# Altium project Multiplexer_SWD.PrjPCB (part 2 of 2)
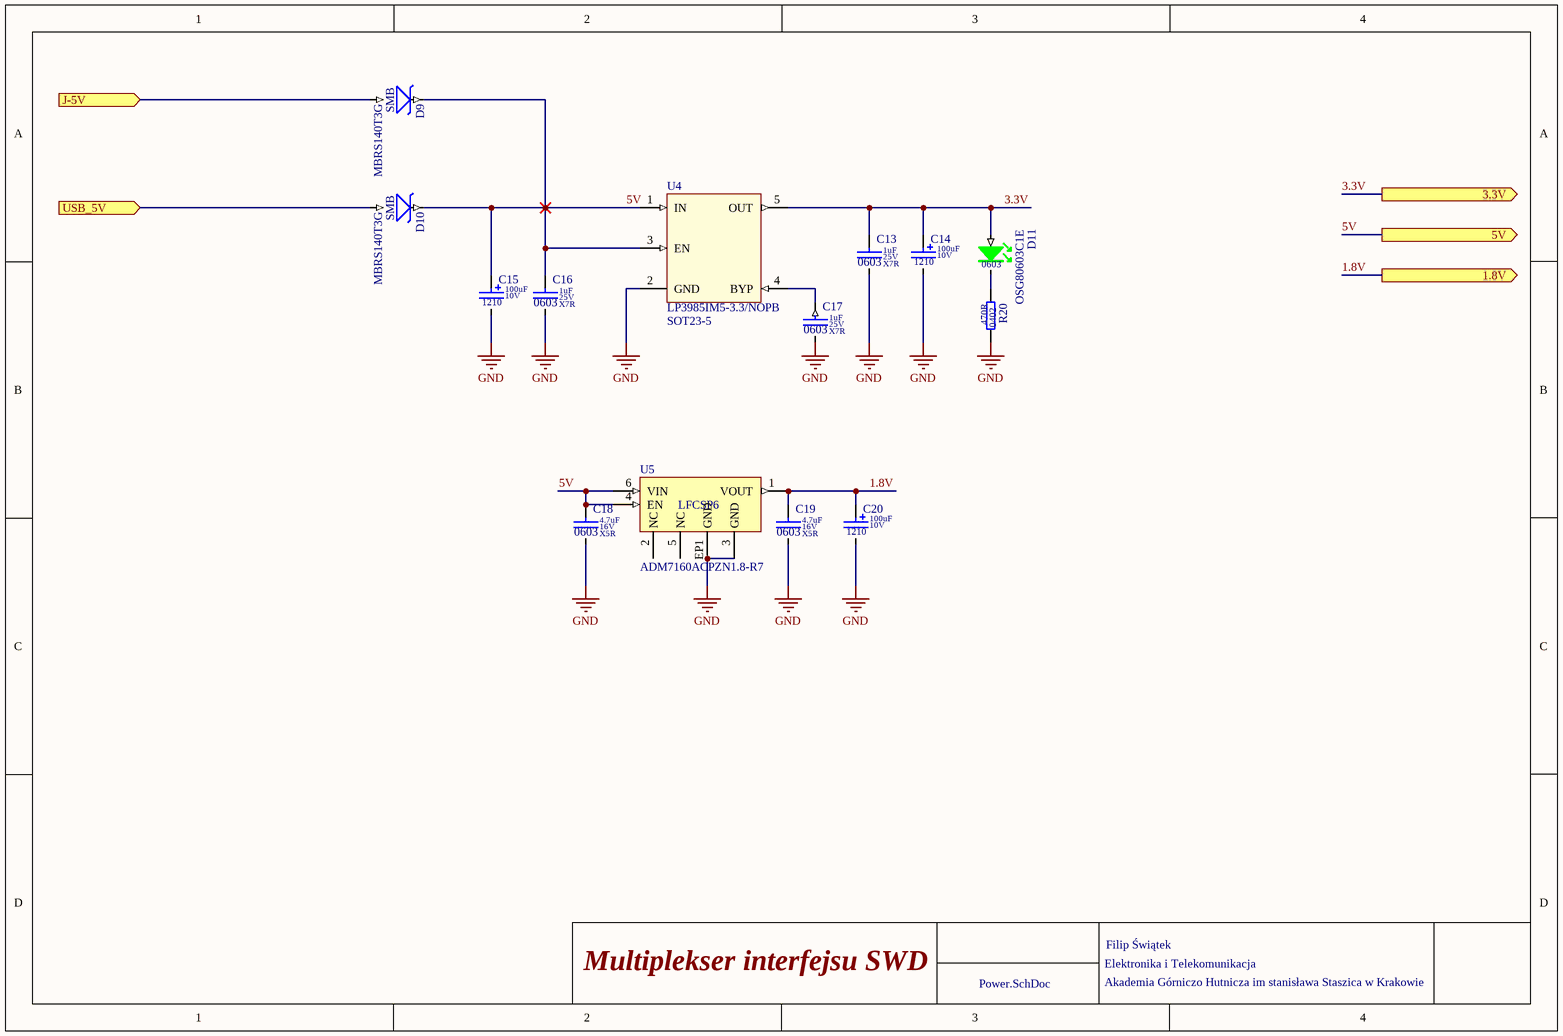
[diagram p7: Power.SchDoc]

## Nets that join several sheets
1.8V: MCU/U_TXS0102YZPR (C1_MCU_U_TXS0102YZPR#1.1 R1_MCU_U_TXS0102YZPR#1.1 U1_MCU_U_TXS0102YZPR#1.C1), MCU/U_TXS0102YZPR (C1_MCU_U_TXS0102YZPR#2.1 R1_MCU_U_TXS0102YZPR#2.1 U1_MCU_U_TXS0102YZPR#2.C1), Power (C19.1 C20.1 U5.1)
3.3V: MCU (15 pins), MCU/U_TXS0102YZPR (C2_MCU_U_TXS0102YZPR#2.1 U1_MCU_U_TXS0102YZPR#2.B2), Power (C13.1 C14.1 D11.2 U4.5)
5V: MUX_Matrix/nRes_MUX (C12_nRes_MUX.1 U3_nRes_MUX.16), MUX_Matrix/SWO_MUX (C12_SWO_MUX.1 U3_SWO_MUX.16), MUX_Matrix/SWCLK_MUX (C12_SWCLK_MUX.1 U3_SWCLK_MUX.16), MUX_Matrix/SWDIO_MUX (C12_SWDIO_MUX.1 U3_SWDIO_MUX.16), MUX_Matrix/VTREF_MUX (C12_VTREF_MUX.1 U3_VTREF_MUX.16), Power (9 pins)
GND: top (13 pins), MCU (27 pins), MCU/U_TXS0102YZPR (C1_MCU_U_TXS0102YZPR#1.2 C2_MCU_U_TXS0102YZPR#1.2 C3_MCU_U_TXS0102YZPR#1.2 U1_MCU_U_TXS0102YZPR#1.B1), MCU/U_TXS0102YZPR (C1_MCU_U_TXS0102YZPR#2.2 C2_MCU_U_TXS0102YZPR#2.2 C3_MCU_U_TXS0102YZPR#2.2 U1_MCU_U_TXS0102YZPR#2.B1), MUX_Matrix/nRes_MUX (C12_nRes_MUX.2 U2_nRes_MUX.EP1 U3_nRes_MUX.8), MUX_Matrix/SWO_MUX (C12_SWO_MUX.2 U2_SWO_MUX.EP1 U3_SWO_MUX.7 U3_SWO_MUX.8), MUX_Matrix/SWCLK_MUX (C12_SWCLK_MUX.2 U2_SWCLK_MUX.EP1 U3_SWCLK_MUX.7 U3_SWCLK_MUX.8), MUX_Matrix/SWDIO_MUX (C12_SWDIO_MUX.2 U2_SWDIO_MUX.EP1 U3_SWDIO_MUX.7 U3_SWDIO_MUX.8), MUX_Matrix/VTREF_MUX (C12_VTREF_MUX.2 U2_VTREF_MUX.EP1 U3_VTREF_MUX.7 U3_VTREF_MUX.8), MUX_Matrix/target_connectors_CH0 (7 pins), MUX_Matrix/target_connectors_CH1 (7 pins), MUX_Matrix/target_connectors_CH2 (7 pins), MUX_Matrix/target_connectors_CH3 (7 pins), MUX_Matrix/target_connectors_CH4 (7 pins), MUX_Matrix/target_connectors_CH5 (7 pins), MUX_Matrix/target_connectors_CH6 (7 pins), MUX_Matrix/target_connectors_CH7 (7 pins), Power (12 pins)
CH0_INDICATOR: MCU (U1.25), MUX_Matrix/target_connectors_CH0 (D1_target_connectors_CH0.2)
CH1_INDICATOR: MCU (U1.22), MUX_Matrix/target_connectors_CH1 (D1_target_connectors_CH1.2)
CH2_INDICATOR: MCU (U1.21), MUX_Matrix/target_connectors_CH2 (D1_target_connectors_CH2.2)
CH3_INDICATOR: MCU (U1.19), MUX_Matrix/target_connectors_CH3 (D1_target_connectors_CH3.2)
CH4_INDICATOR: MCU (U1.18), MUX_Matrix/target_connectors_CH4 (D1_target_connectors_CH4.2)
CH5_INDICATOR: MCU (U1.17), MUX_Matrix/target_connectors_CH5 (D1_target_connectors_CH5.2)
CH6_INDICATOR: MCU (U1.14), MUX_Matrix/target_connectors_CH6 (D1_target_connectors_CH6.2)
CH7_INDICATOR: MCU (U1.13), MUX_Matrix/target_connectors_CH7 (D1_target_connectors_CH7.2)
HARD_RES_ALL: MCU (U1.15), MUX_Matrix/target_connectors_CH0 (Q1_target_connectors_CH0.1), MUX_Matrix/target_connectors_CH1 (Q1_target_connectors_CH1.1), MUX_Matrix/target_connectors_CH2 (Q1_target_connectors_CH2.1), MUX_Matrix/target_connectors_CH3 (Q1_target_connectors_CH3.1), MUX_Matrix/target_connectors_CH4 (Q1_target_connectors_CH4.1), MUX_Matrix/target_connectors_CH5 (Q1_target_connectors_CH5.1), MUX_Matrix/target_connectors_CH6 (Q1_target_connectors_CH6.1), MUX_Matrix/target_connectors_CH7 (Q1_target_connectors_CH7.1)
J-5V: top (P6.19), Power (D9.2)
J-nRES: top (P6.15), MUX_Matrix/nRes_MUX (U3_nRes_MUX.5)
J-nRES_~{EN}: MCU (U1.16), MUX_Matrix/nRes_MUX (U3_nRes_MUX.7)
J-SWCLK: top (P6.9), MUX_Matrix/SWCLK_MUX (U3_SWCLK_MUX.5)
J-SWDIO: top (P6.7), MUX_Matrix/SWDIO_MUX (U3_SWDIO_MUX.5)
J-SWO: top (P6.13), MUX_Matrix/SWO_MUX (U3_SWO_MUX.5)
J-VTref: top (P6.1), MCU/U_TXS0102YZPR (C2_MCU_U_TXS0102YZPR#1.1 U1_MCU_U_TXS0102YZPR#1.B2), MUX_Matrix/VTREF_MUX (U3_VTREF_MUX.5)
MCU_RX: top (P6.5), MCU/U_TXS0102YZPR (U1_MCU_U_TXS0102YZPR#1.A1)
MCU_RX_1.8V: MCU/U_TXS0102YZPR (U1_MCU_U_TXS0102YZPR#1.D1), MCU/U_TXS0102YZPR (U1_MCU_U_TXS0102YZPR#2.D1)
MCU_RX_3.3V: MCU (U1.31), MCU/U_TXS0102YZPR (U1_MCU_U_TXS0102YZPR#2.A1)
MCU_TX: top (P6.17), MCU/U_TXS0102YZPR (U1_MCU_U_TXS0102YZPR#1.A2)
MCU_TX_1.8V: MCU/U_TXS0102YZPR (U1_MCU_U_TXS0102YZPR#1.D2), MCU/U_TXS0102YZPR (U1_MCU_U_TXS0102YZPR#2.D2)
MCU_TX_3.3V: MCU (U1.30), MCU/U_TXS0102YZPR (U1_MCU_U_TXS0102YZPR#2.A2)
nRST0: MUX_Matrix/nRes_MUX (U2_nRes_MUX.9), MUX_Matrix/target_connectors_CH0 (P3_target_connectors_CH0.10 P5_target_connectors_CH0.10 Q1_target_connectors_CH0.3)
nRST1: MUX_Matrix/nRes_MUX (U2_nRes_MUX.10), MUX_Matrix/target_connectors_CH1 (P3_target_connectors_CH1.10 P5_target_connectors_CH1.10 Q1_target_connectors_CH1.3)
nRST2: MUX_Matrix/nRes_MUX (U2_nRes_MUX.11), MUX_Matrix/target_connectors_CH2 (P3_target_connectors_CH2.10 P5_target_connectors_CH2.10 Q1_target_connectors_CH2.3)
nRST3: MUX_Matrix/nRes_MUX (U2_nRes_MUX.12), MUX_Matrix/target_connectors_CH3 (P3_target_connectors_CH3.10 P5_target_connectors_CH3.10 Q1_target_connectors_CH3.3)
nRST4: MUX_Matrix/nRes_MUX (U2_nRes_MUX.13), MUX_Matrix/target_connectors_CH4 (P3_target_connectors_CH4.10 P5_target_connectors_CH4.10 Q1_target_connectors_CH4.3)
nRST5: MUX_Matrix/nRes_MUX (U2_nRes_MUX.14), MUX_Matrix/target_connectors_CH5 (P3_target_connectors_CH5.10 P5_target_connectors_CH5.10 Q1_target_connectors_CH5.3)
nRST6: MUX_Matrix/nRes_MUX (U2_nRes_MUX.15), MUX_Matrix/target_connectors_CH6 (P3_target_connectors_CH6.10 P5_target_connectors_CH6.10 Q1_target_connectors_CH6.3)
nRST7: MUX_Matrix/nRes_MUX (U2_nRes_MUX.16), MUX_Matrix/target_connectors_CH7 (P3_target_connectors_CH7.10 P5_target_connectors_CH7.10 Q1_target_connectors_CH7.3)
SELECT_0: MCU (U1.10), MUX_Matrix/nRes_MUX (U3_nRes_MUX.9), MUX_Matrix/SWO_MUX (U3_SWO_MUX.9), MUX_Matrix/SWCLK_MUX (U3_SWCLK_MUX.9), MUX_Matrix/SWDIO_MUX (U3_SWDIO_MUX.9), MUX_Matrix/VTREF_MUX (U3_VTREF_MUX.9)
SELECT_1: MCU (U1.11), MUX_Matrix/nRes_MUX (U3_nRes_MUX.10), MUX_Matrix/SWO_MUX (U3_SWO_MUX.10), MUX_Matrix/SWCLK_MUX (U3_SWCLK_MUX.10), MUX_Matrix/SWDIO_MUX (U3_SWDIO_MUX.10), MUX_Matrix/VTREF_MUX (U3_VTREF_MUX.10)
SELECT_2: MCU (U1.12), MUX_Matrix/nRes_MUX (U3_nRes_MUX.11), MUX_Matrix/SWO_MUX (U3_SWO_MUX.11), MUX_Matrix/SWCLK_MUX (U3_SWCLK_MUX.11), MUX_Matrix/SWDIO_MUX (U3_SWDIO_MUX.11), MUX_Matrix/VTREF_MUX (U3_VTREF_MUX.11)
SWCLK0: MUX_Matrix/SWCLK_MUX (U2_SWCLK_MUX.9), MUX_Matrix/target_connectors_CH0 (P3_target_connectors_CH0.4 P5_target_connectors_CH0.4)
SWCLK1: MUX_Matrix/SWCLK_MUX (U2_SWCLK_MUX.10), MUX_Matrix/target_connectors_CH1 (P3_target_connectors_CH1.4 P5_target_connectors_CH1.4)
SWCLK2: MUX_Matrix/SWCLK_MUX (U2_SWCLK_MUX.11), MUX_Matrix/target_connectors_CH2 (P3_target_connectors_CH2.4 P5_target_connectors_CH2.4)
SWCLK3: MUX_Matrix/SWCLK_MUX (U2_SWCLK_MUX.12), MUX_Matrix/target_connectors_CH3 (P3_target_connectors_CH3.4 P5_target_connectors_CH3.4)
SWCLK4: MUX_Matrix/SWCLK_MUX (U2_SWCLK_MUX.13), MUX_Matrix/target_connectors_CH4 (P3_target_connectors_CH4.4 P5_target_connectors_CH4.4)
SWCLK5: MUX_Matrix/SWCLK_MUX (U2_SWCLK_MUX.14), MUX_Matrix/target_connectors_CH5 (P3_target_connectors_CH5.4 P5_target_connectors_CH5.4)
SWCLK6: MUX_Matrix/SWCLK_MUX (U2_SWCLK_MUX.15), MUX_Matrix/target_connectors_CH6 (P3_target_connectors_CH6.4 P5_target_connectors_CH6.4)
SWCLK7: MUX_Matrix/SWCLK_MUX (U2_SWCLK_MUX.16), MUX_Matrix/target_connectors_CH7 (P3_target_connectors_CH7.4 P5_target_connectors_CH7.4)
SWDIO0: MUX_Matrix/SWDIO_MUX (U2_SWDIO_MUX.9), MUX_Matrix/target_connectors_CH0 (P3_target_connectors_CH0.2 P5_target_connectors_CH0.2)
SWDIO1: MUX_Matrix/SWDIO_MUX (U2_SWDIO_MUX.10), MUX_Matrix/target_connectors_CH1 (P3_target_connectors_CH1.2 P5_target_connectors_CH1.2)
SWDIO2: MUX_Matrix/SWDIO_MUX (U2_SWDIO_MUX.11), MUX_Matrix/target_connectors_CH2 (P3_target_connectors_CH2.2 P5_target_connectors_CH2.2)
SWDIO3: MUX_Matrix/SWDIO_MUX (U2_SWDIO_MUX.12), MUX_Matrix/target_connectors_CH3 (P3_target_connectors_CH3.2 P5_target_connectors_CH3.2)
SWDIO4: MUX_Matrix/SWDIO_MUX (U2_SWDIO_MUX.13), MUX_Matrix/target_connectors_CH4 (P3_target_connectors_CH4.2 P5_target_connectors_CH4.2)
SWDIO5: MUX_Matrix/SWDIO_MUX (U2_SWDIO_MUX.14), MUX_Matrix/target_connectors_CH5 (P3_target_connectors_CH5.2 P5_target_connectors_CH5.2)
SWDIO6: MUX_Matrix/SWDIO_MUX (U2_SWDIO_MUX.15), MUX_Matrix/target_connectors_CH6 (P3_target_connectors_CH6.2 P5_target_connectors_CH6.2)
SWDIO7: MUX_Matrix/SWDIO_MUX (U2_SWDIO_MUX.16), MUX_Matrix/target_connectors_CH7 (P3_target_connectors_CH7.2 P5_target_connectors_CH7.2)
SWO0: MUX_Matrix/SWO_MUX (U2_SWO_MUX.9), MUX_Matrix/target_connectors_CH0 (P3_target_connectors_CH0.6 P5_target_connectors_CH0.6)
SWO1: MUX_Matrix/SWO_MUX (U2_SWO_MUX.10), MUX_Matrix/target_connectors_CH1 (P3_target_connectors_CH1.6 P5_target_connectors_CH1.6)
SWO2: MUX_Matrix/SWO_MUX (U2_SWO_MUX.11), MUX_Matrix/target_connectors_CH2 (P3_target_connectors_CH2.6 P5_target_connectors_CH2.6)
SWO3: MUX_Matrix/SWO_MUX (U2_SWO_MUX.12), MUX_Matrix/target_connectors_CH3 (P3_target_connectors_CH3.6 P5_target_connectors_CH3.6)
SWO4: MUX_Matrix/SWO_MUX (U2_SWO_MUX.13), MUX_Matrix/target_connectors_CH4 (P3_target_connectors_CH4.6 P5_target_connectors_CH4.6)
SWO5: MUX_Matrix/SWO_MUX (U2_SWO_MUX.14), MUX_Matrix/target_connectors_CH5 (P3_target_connectors_CH5.6 P5_target_connectors_CH5.6)
SWO6: MUX_Matrix/SWO_MUX (U2_SWO_MUX.15), MUX_Matrix/target_connectors_CH6 (P3_target_connectors_CH6.6 P5_target_connectors_CH6.6)
SWO7: MUX_Matrix/SWO_MUX (U2_SWO_MUX.16), MUX_Matrix/target_connectors_CH7 (P3_target_connectors_CH7.6 P5_target_connectors_CH7.6)
USB_5V: top (J1.1 R22.2 U6.5), Power (D10.2)
USB_D_N: top (U6.6), MCU (R8.1)
USB_D_P: top (U6.4), MCU (R7.1 R9.1)
USB_power indicator: top (R22.1 R23.2), MCU (U1.29)
VTREF0: MUX_Matrix/VTREF_MUX (U2_VTREF_MUX.9), MUX_Matrix/target_connectors_CH0 (P3_target_connectors_CH0.1 P5_target_connectors_CH0.1)
VTREF1: MUX_Matrix/VTREF_MUX (U2_VTREF_MUX.10), MUX_Matrix/target_connectors_CH1 (P3_target_connectors_CH1.1 P5_target_connectors_CH1.1)
VTREF2: MUX_Matrix/VTREF_MUX (U2_VTREF_MUX.11), MUX_Matrix/target_connectors_CH2 (P3_target_connectors_CH2.1 P5_target_connectors_CH2.1)
VTREF3: MUX_Matrix/VTREF_MUX (U2_VTREF_MUX.12), MUX_Matrix/target_connectors_CH3 (P3_target_connectors_CH3.1 P5_target_connectors_CH3.1)
VTREF4: MUX_Matrix/VTREF_MUX (U2_VTREF_MUX.13), MUX_Matrix/target_connectors_CH4 (P3_target_connectors_CH4.1 P5_target_connectors_CH4.1)
VTREF5: MUX_Matrix/VTREF_MUX (U2_VTREF_MUX.14), MUX_Matrix/target_connectors_CH5 (P3_target_connectors_CH5.1 P5_target_connectors_CH5.1)
VTREF6: MUX_Matrix/VTREF_MUX (U2_VTREF_MUX.15), MUX_Matrix/target_connectors_CH6 (P3_target_connectors_CH6.1 P5_target_connectors_CH6.1)
VTREF7: MUX_Matrix/VTREF_MUX (U2_VTREF_MUX.16), MUX_Matrix/target_connectors_CH7 (P3_target_connectors_CH7.1 P5_target_connectors_CH7.1)